# Altium project LoRaBaseStation.PrjPcb
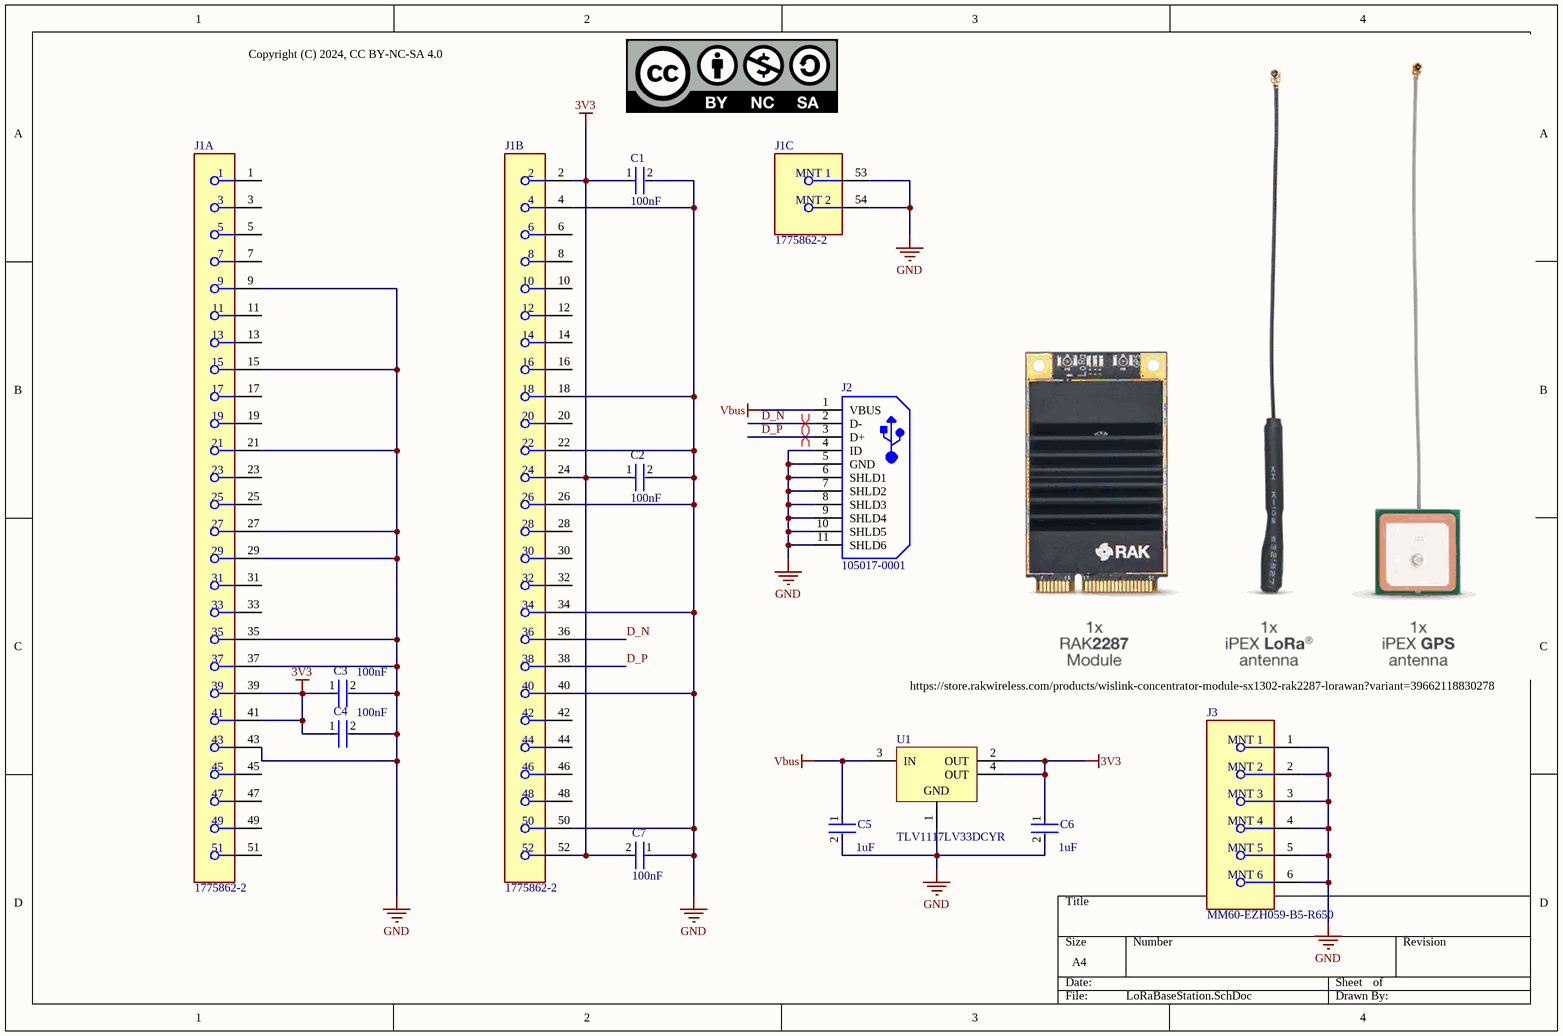
[diagram p0: LoRaBaseStation.SchDoc]
1 sheet, 11 parts. Net scope: global (net labels, ports and power ports of the same name join across sheets).
Board file: LoRaBaseStation.PcbDoc

## Sheet LoRaBaseStation.SchDoc
size A4; SheetNumber: 1; SheetTotal: 1

### Parts
C1  Capacitance: 100nF  [FP-GRM155-0_05-IPC_C]  (hidden comment: GRM155R71E104KE14J)
C2  Capacitance: 100nF  [FP-GRM155-0_05-IPC_C]  (hidden comment: GRM155R71E104KE14J)
C3  Capacitance: 100nF  [FP-GRM155-0_05-IPC_C]  (hidden comment: GRM155R71E104KE14J)
C4  Capacitance: 100nF  [FP-GRM155-0_05-IPC_C]  (hidden comment: GRM155R71E104KE14J)
C5  Capacitance: 1uF  [FP-CL511-IPC_C]  (hidden comment: CL05A105KP5NNNC)
C6  Capacitance: 1uF  [FP-CL511-IPC_C]  (hidden comment: CL05A105KP5NNNC)
C7  Capacitance: 100nF  [FP-GRM155-0_05-IPC_C]  (hidden comment: GRM155R71E104KE14J)
J1  1775862-2  [FP-1775862-2-MFG]  (parts A,B,C of 3)
J2  105017-0001  [USB-MICRO-B_V]
J3  MM60-EZH059-B5-R650  [FP-MM60-EZH059-B5-R650-MFG]
U1  TLV1117LV33DCYR  [DCY0004A_N]

### Nets
3V3: C1.1 C2.1 C3.1 C4.1 C6.1 C7.2 J1.2 J1.24 J1.39 J1.41 J1.52 U1.2(OUT) U1.4(OUT)
GND: C1.2 C2.2 C3.2 C4.2 C5.2 C6.2 C7.1 J1.4 J1.9 J1.15 J1.18 J1.21 J1.22 J1.26 J1.27 J1.29 J1.34 J1.35 J1.37 J1.40 J1.43 J1.50 J1.53(MNT_1) J1.54(MNT_2) J2.4(ID) J2.5(GND) J2.6(SHLD1) J2.7(SHLD2) J2.8(SHLD3) J2.9(SHLD4) J2.10(SHLD5) J2.11(SHLD6) J3.1(MNT_1) J3.2(MNT_2) J3.3(MNT_3) J3.4(MNT_4) J3.5(MNT_5) J3.6(MNT_6) U1.1(GND)
Vbus: C5.1 J2.1(VBUS) U1.3(IN)
D_N: J1.36 J2.2(D-)
D_P: J1.38 J2.3(D+)

Not connected (* = marked no-connect by the designer): J1 1 3 5 6 7 8 10 11 12 13 14 16 17 19 20 23 25 28 30 31 32 33 42 44 45 46 47 48 49 51

### Layout directives
differential pair: D_N, D_P

### Notes on the sheet
- Copyright (C) 2024, CC BY-NC-SA 4.0
- https://store.rakwireless.com/products/wislink-concentrator-module-sx1302-rak2287-lorawan?variant=39662118830278

### Library data of the parts
C1-C4 C7 = CMP-06035-003995-1: Chip Multilayer Ceramic Capacitors for General Purpose, 0402, 0.10uF, X7R, 15%, 10%, 25V; Resistor Type: Ceramic; Tolerance: 10%; Case Code (Metric): 1005; Termination: SMD/SMT; Mount: Surface Mount; Voltage Rating: 25V; Voltage Rating (DC): 25V; Case Code (Imperial): 0402; Max Operating Temperature: 125°C; Weight: 0.000212oz; Case/Package: 0402; Length: 0.039inch; Width: 0.5mm; Thickness: 0.022inch; Height: 0.5mm; Packaging: Tape and Reel; Package Quantity: 50000; Min Operating Temperature: -55°C; Dielectric: X7R
C5 C6 = CMP-13271-001936-1: Cap Ceramic 1uF 10V X5R ±10% SMD 0402 +85°C Paper T/R; Depth: 0.5mm; Case Code (Imperial): 0402; Material: Ceramic; Mount: Surface Mount; Thickness: 0.022inch; Dielectric: X5R; Radiation Hardening: No; Case/Package: 0402; Length: 1mm; Tolerance: 10%; Max Operating Temperature: 85°C; Package Quantity: 1; Width: 0.02inch; Voltage Rating: 10V; Contact Plating: Tin; Height: 0.5mm; Min Operating Temperature: -55°C; Case Code (Metric): 1005; Packaging: Tape and Reel
J1 = CMP-03365-000003-1: CONN PCI EXP MINI FEMALE 52POS; High Temperature Housing: Yes; Number of Contacts: 52; Stackable: No; Stack Height: 5.2mm; Row Spacing: 0.031inch; PCB Mounting Orientation: Horizontal; Connector Type: Receptacle; Pitch: 0.8mm; PCB Mount Retention: Without; Mount: Surface Mount; Housing Color: Black; Termination: Solder; ELV: Compliant; Housing Material: Thermoplastic; Contact Plating: Gold; Contact Material: Copper Alloy; RoHS Compliant: Yes; Flammability Rating: UL94 V-0; Lead Free: Contains Lead; Number of Rows: 2; Package Quantity: 550; Packaging: Tape and Reel; Orientation: Right Angle; Radiation Hardening: No; Number of Positions: 52
J2 = CMP-2000-05827-1: Micro-USB B Receptacle, Right Angle, Bottom Mount, Surface Mount, with Solder Tabs, -30 to 85 degC, 5-Pin USB, RoHS, Tape and Reel; Manufacturer: Molex; Featured Product: Micro-USBConnectorsUSBConnectors; Other Names: WM1399DKR; Package Version: Rev. F, 12/2012; Number of Contacts: 5; Connector Type: USB-microB; Catalog Drawings: 1050170001; 3D Model: 105017-0001.stp; Mating Products: WM17145-ND-CABLEMICROUSBBTOSTDA1.0MWM17147-ND-CABLEMICROUSBBTOSTDA2.0MWM17146-ND-CABLEMICROUSBBTOSTDA1.5M; PCN Assembly/Origin: ResinSupplier21/Oct/2015; Voltage - Max: 30V; Online Catalog: Molex-MicroUSB; Manufacturer URL: http://www.molex.com/; Package Description: 5-Leads USB, Micro B, Body 7.5 x 5 mm, Pitch 0.65 mm; Datasheet URL: http://www.molex.com/elqNow/elqRedir.htm?ref=http://www.molex.com/webdocs/datasheets/pdf/en-us/1050170001_IO_CONNECTORS.pdf; Ingress Protection: -; Datasheet Version: 03/2016; Mounting Type: BoardCutout,SurfaceMount,RightAngle; Circuits: 5; Standard Package: 1; Package Reference: MICRO-B; Package URL: http://www.molex.com/pdm_docs/sd/1050170001_sd.pdf; Category: Connectors,Interconnects; Series: -; RoHS Information: 1050170001CertofCompliance; Features: Shielded,SolderRetention; Family: USB,DVI,HDMIConnectors; Specifications: -; Gender: Receptacle; Packaging: Digi-Reel®; Mounting Technology: SurfaceMount
J3 = CMP-19043-000001-1: CONN MINI EXPRESS CARD LATCH SMD; Contact Resistance: 55mR; Mating Cycles: 50; Current Rating: 500mA; Max Operating Temperature: 80°C; Series: MM60; Height: 5.9mm; Flammability Rating: UL94 V-0; Contact Material: Stainless Steel; Packaging: Tape and Reel; Termination: Solder; Contact Plating: Tin; Min Operating Temperature: -40°C; Package Quantity: 1; RoHS Compliant: Yes; Case/Package: SMD/SMT; Mount: Socket
U1 = CMP-0395-00503-2: Single Output LDO, 1 A, Fixed 3.3 V Output, 2 to 5.5 V Input, 4-pin SOT-223 (DCY), -40 to 125 degC, Green (RoHS & no Sb/Br); Manufacturer: Texas Instruments; Vout Adj(Min)(V): 3.3; Vdo(Typ)(mV): 1200; Iq(Typ)(mA): 0.05; Accuracy(%): 2; Iout(Max)(A): 1; SubFamily: Single Channel LDO; Vin(Max)(V): 5.5; PackageReference: DCY0004A; PackageDescription: 4-Pin Plastic Small Outline, Body 3.5 x 6.5 mm, Pitch 2.3 mm; Vout Adj(Max)(V): 3.3; Mounting Technology: Surface Mount; ComponentLink2Description: Datasheet; ComponentLink1Description: Manufacturer URL; PartNumber: TLV1117LV33DCYR; ComponentLink3Description: Package Specification; ComponentLink1URL: http://www.ti.com/; ComponentLink2URL: http://www.ti.com/general/docs/lit/getliterature.tsp?genericPartNumber=TLV1117LV33&fileType=pdf; Fixed Output Options(V): 3.3; PackageVersion: 4202506/B; Vin(Min)(V): 2; DatasheetVersion: SBVS160A; Eco-Plan: Green (RoHS & no Sb/Br); ComponentLink3URL: http://www.ti.com/litv/pdf/mpds094a; Code_JEDEC: TO-261